# EAGLE schematic PayloadSheildV5.1 (EAGLE 6.2)
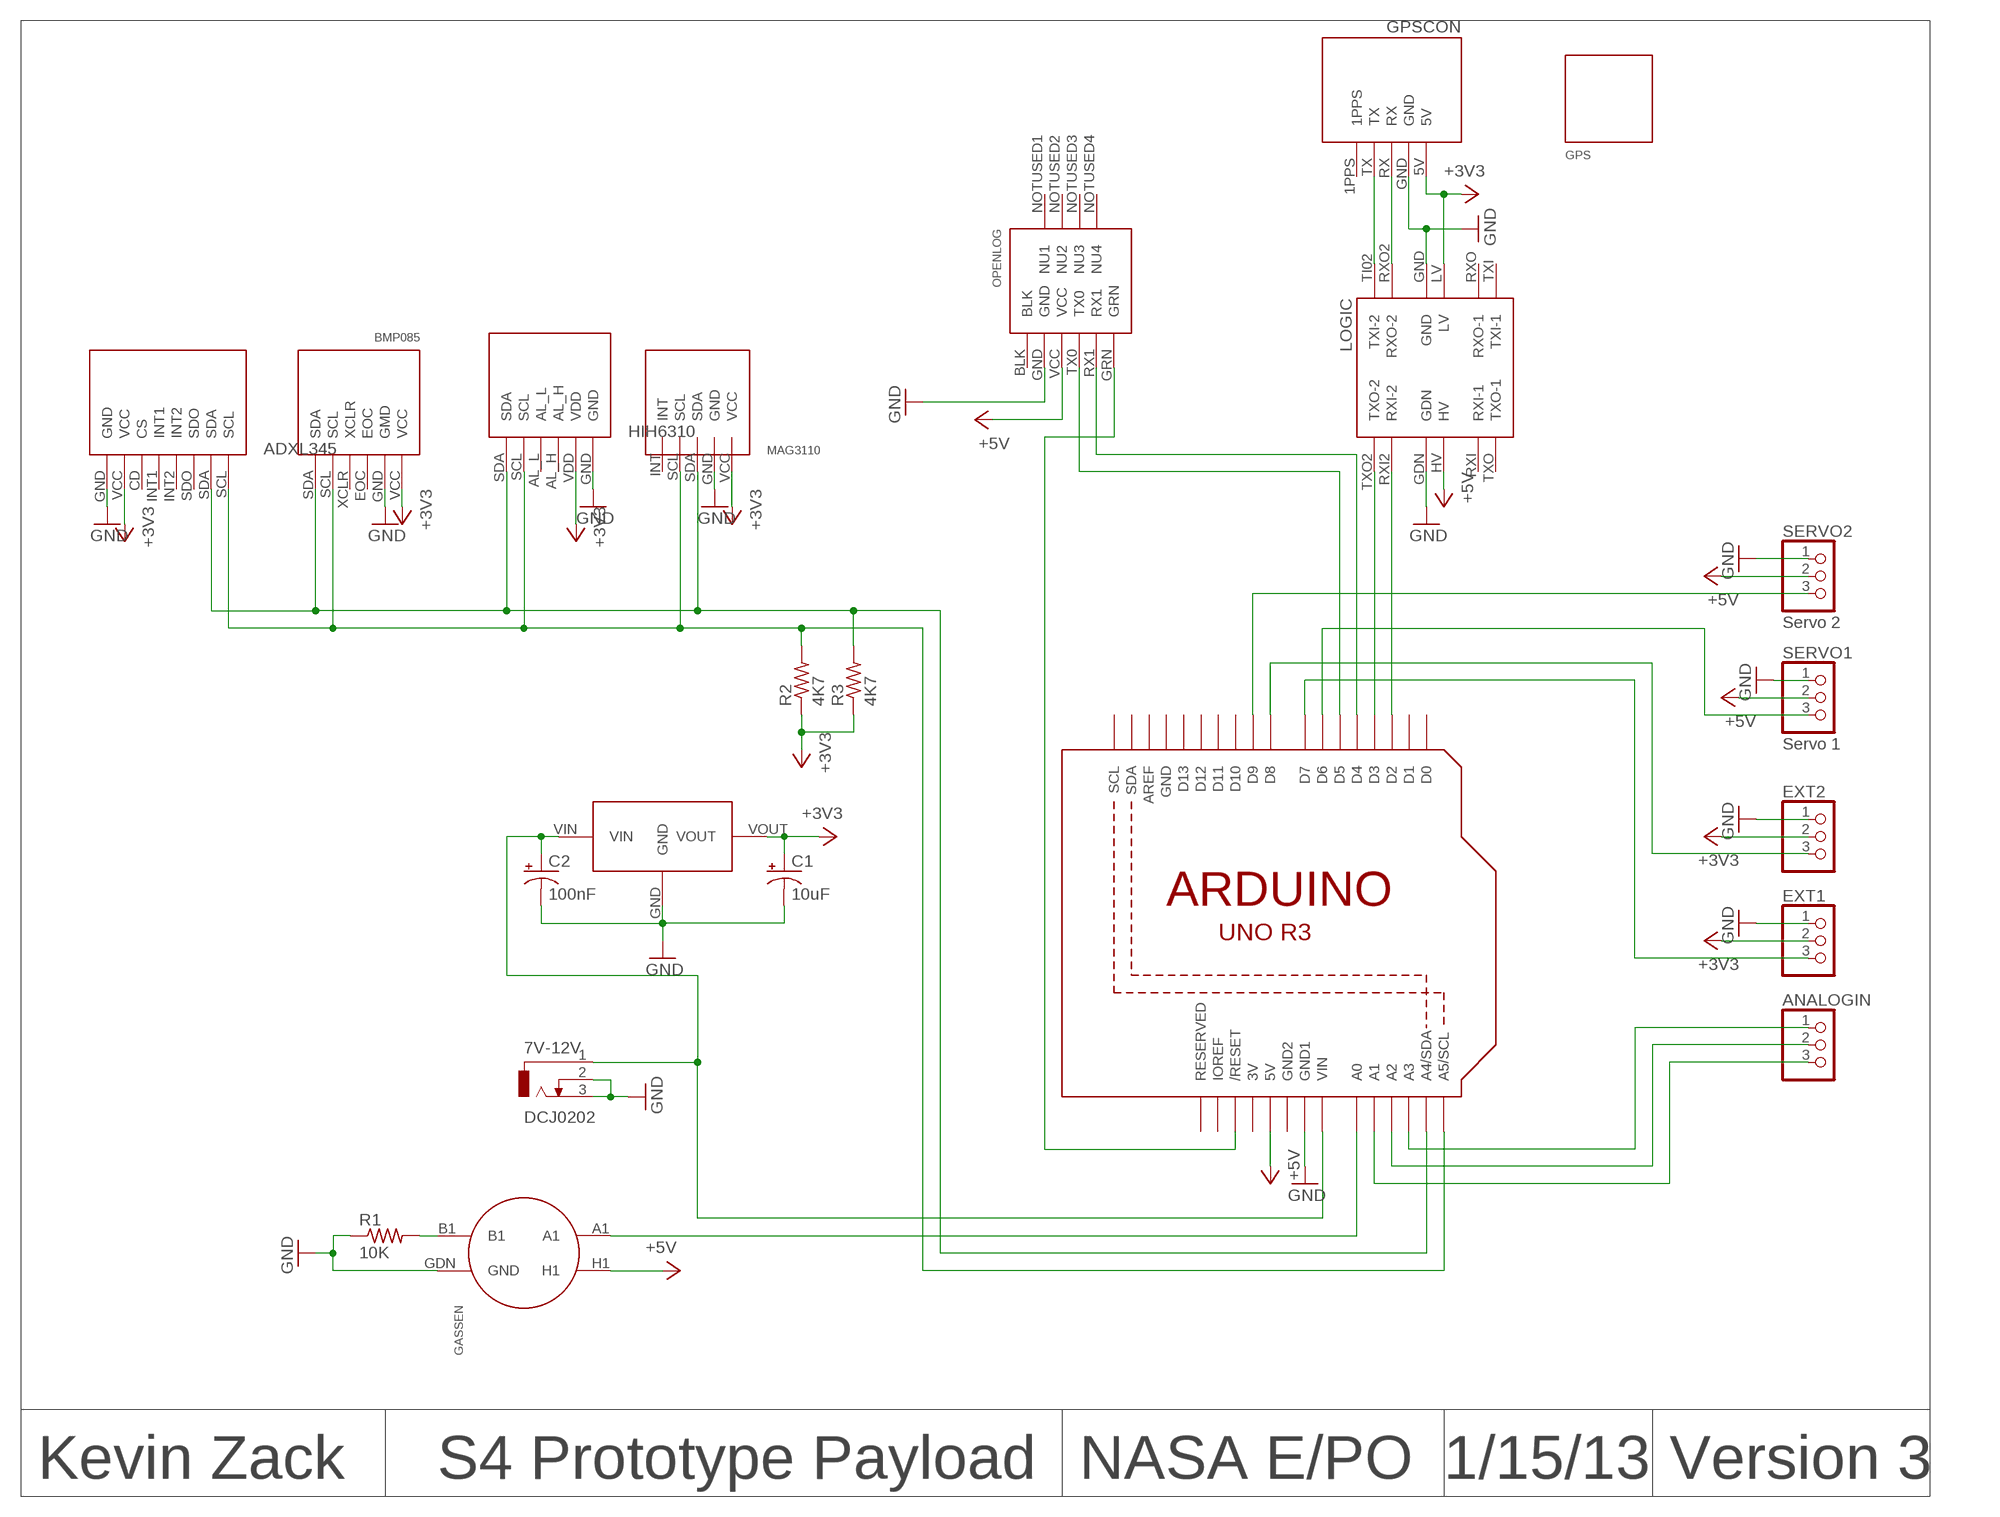
[diagram p0: schematic, sheet 1]

## Parts
3.3V  LD1117V33  [LD1117V33]
7V-12V  DCJ0202  [DCJ0202]
ADXL345  ADXL345  [ADXL345+]
ANALOGIN  PINHD-1X3  [1X03]
BMP085  BMP085  [BMP085]
C1  10uF  CPOL-USE2.5-6  [E2,5-6]
C2  100nF  CPOL-USE2.5-6  [E2,5-6]
EXT1  PINHD-1X3  [1X03]
EXT2  PINHD-1X3  [1X03]
GASSEN  GAS  [GAS]
GPS  GPS  [GPS]
GPSCON  EM407CONNECTOR  [EM407CONNECTOR]
HIH6310  HIH6130  [HIH6130]
LOGIC  LOGICCONVERTER  [LOGICCONVERTER]
MAG3110  MAG3110  [MAG3110]
OPENLOG  OPENLOG  [OPENLOG]
R1  10K  R-US_0204/5  [0204/5]
R2  4K7  R-US_0204/5  [0204/5]
R3  4K7  R-US_0204/5  [0204/5]
SERVO1  Servo 1  PINHD-1X3  [1X03]
SERVO2  Servo 2  PINHD-1X3  [1X03]
U2  ARDUINOR3  [ARDUINOR3]

## Nets
+3V3: 3.3V.VOUT ADXL345.VCC BMP085.VCC C1.+ EXT1.2 EXT2.2 GPSCON.5V HIH6310.VDD LOGIC.LV MAG3110.VCC R2.1 R3.1
+5V: GASSEN.H1 LOGIC.HV OPENLOG.VCC SERVO1.2 SERVO2.2 U2.5V
GND: 3.3V.GND 7V-12V.2 7V-12V.3 ADXL345.GND BMP085.GND(GMD) C1.- C2.- EXT1.1 EXT2.1 GASSEN.GDN(GND) GPSCON.GND HIH6310.GND LOGIC.GDN LOGIC.GND MAG3110.GND OPENLOG.GND R1.1 SERVO1.1 SERVO2.1 U2.GND1
N$1: GASSEN.A1 U2.A0
N$2: GPSCON.RX LOGIC.RXO2(RXO-2)
N$3: OPENLOG.GRN U2.RESET(/RESET)
N$4: GASSEN.B1 R1.2
N$5: OPENLOG.RX1 U2.D4
N$6: OPENLOG.TX0 U2.D5
N$7: SERVO2.3 U2.D9
N$9: ADXL345.SCL BMP085.SCL HIH6310.SCL MAG3110.SCL R2.2 U2.A5(A5/SCL)
N$10: ANALOGIN.1 U2.A3
N$11: SERVO1.3 U2.D6
N$12: ANALOGIN.2 U2.A2
N$27: ANALOGIN.3 U2.A1
N$28: 3.3V.VIN 7V-12V.1 C2.+ U2.VIN
N$32: GPSCON.TX LOGIC.TI02(TXI-2)
N$35: LOGIC.RXI2(RXI-2) U2.D2
N$36: EXT1.3 U2.D7
N$40: EXT2.3 U2.D8
N$41: LOGIC.TXO2(TXO-2) U2.D3
SDA: ADXL345.SDA BMP085.SDA HIH6310.SDA MAG3110.SDA R3.2 U2.A4(A4/SDA)
Unconnected: ADXL345.CD(CS) ADXL345.INT1 ADXL345.INT2 ADXL345.SDO BMP085.EOC BMP085.XCLR GPSCON.1PPS HIH6310.AL_H HIH6310.AL_L LOGIC.RXI(RXI-1) LOGIC.RXO(RXO-1) LOGIC.TXI(TXI-1) LOGIC.TXO(TXO-1) MAG3110.INT OPENLOG.BLK OPENLOG.NOTUSED1(NU1) OPENLOG.NOTUSED2(NU2) OPENLOG.NOTUSED3(NU3) OPENLOG.NOTUSED4(NU4) U2.AREF U2.D0 U2.D1 U2.D10 U2.D11 U2.D12 U2.D13 U2.IOREF U2.RESERVED U2.SCL U2.SDA

## Notes on the sheet
- Kevin Zack | S4 Prototype Payload | NASA E/PO | 1/15/13 | Version 3

## Power pins joined to a net without a drawn wire
3V: U2.3V
GND: U2.GND
GND2: U2.GND2

## Library data of the parts
3.3V = TEMP:LD1117V33
7V-12V = con-jack:DCJ0202: DC POWER JACK Source: DCJ0202.pdf; OC_FARNELL: unknown; OC_NEWARK: unknown
ADXL345 = NASAEPO:ADXL345
ANALOGIN EXT1 EXT2 SERVO1 SERVO2 = adafruit:PINHD-1X3: PIN HEADER
BMP085 = NASAEPO:BMP085
C1 C2 = rcl:CPOL-US: POLARIZED CAPACITOR, American symbol
GASSEN = NASAEPO:GAS
GPS = NASAEPO:GPS
GPSCON = NASAEPO:EM407CONNECTOR
HIH6310 = NASAEPO:HIH6130
LOGIC = NASAEPO:LOGICCONVERTER
MAG3110 = NASAEPO:MAG3110
OPENLOG = NASAEPO:OPENLOG
R1-R3 = rcl:R-US_: RESISTOR, American symbol
U2 = NASAEPO:ARDUINOR3: This is a new object for the new Arduino R3 - with extra pins that you may want to use (such as IOref, and duplicated A4/A5